# EAGLE design Automotive Car Cover with anti-theft alert system (EAGLE 7.6.0)
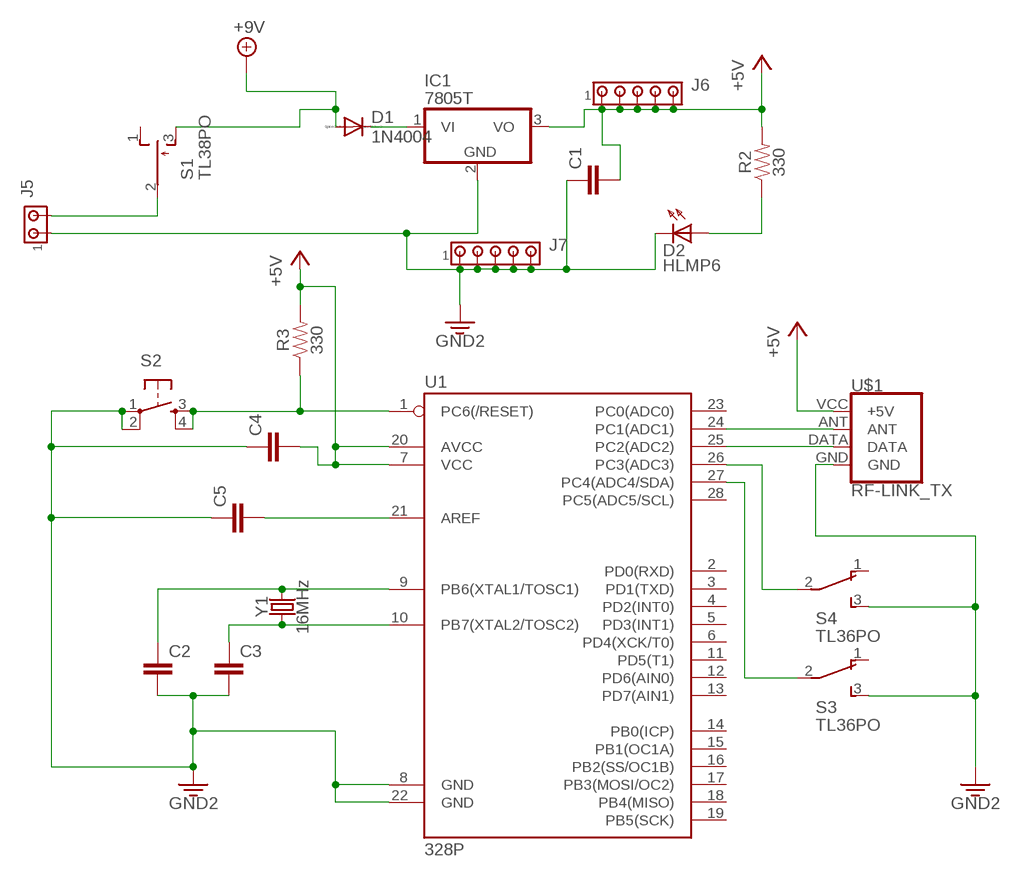
[diagram p0: schematic, sheet 1]

## Parts
C1  C5/2.5  [C5B2.5]
C2  C5/2.5  [C5B2.5]
C3  C5/2.5  [C5B2.5]
C4  C5/2.5  [C5B2.5]
C5  C5/2.5  [C5B2.5]
D1  1N4004  [DO41-10]
D2  HLMP6  [HLMP6]
IC1  7805T  [TO220H]
J5  MTA02-156  [1X2MTA]
J6  MTA05-100  [10X05MTA]
J7  MTA05-100  [10X05MTA]
R2  330  330OHM-HORIZ-1/10W-5%  [AXIAL-0.3]
R3  330  330OHM-HORIZ-1/10W-5%  [AXIAL-0.3]
S1  TL38PO  [TL3XPO]
S2  TAC_SWITCHPTH  [TACTILE-PTH]
S3  TL36PO  [TL3XPO]
S4  TL36PO  [TL3XPO]
U1  328P  ATMEGA328P_PDIP  [DIP28]
U$1  RF-LINK_TX  [RF-LINK_TX]
Y1  16MHz  CRYSTAL-16MHZPTH-HC49US  [HC49US]

## Nets
3.3V: C1.1 C2.2 C3.2 C4.1 C5.1 D2.K IC1.2(GND) J5.1 J7.1 J7.2 J7.3 J7.4 J7.5 S2.1 S2.2 S3.3(S) S4.3(S) U1.8(GND) U1.22(GND) U$1.GND ; supply symbol labelled GND2
+5V: C1.2 C4.2 IC1.3(VO) J6.1 J6.2 J6.3 J6.4 J6.5 R2.P$2 R3.P$2 U1.7(VCC) U1.20(AVCC) U$1.VCC(+5V)
+9V: D1.A S1.3(S)
N$1: R3.P$1 S2.3 S2.4 U1.1(PC6(/RESET))
N$3: U1.25(PC2(ADC2)) U$1.DATA
N$4: C5.2 U1.21(AREF)
N$5: C2.1 U1.9(PB6(XTAL1/TOSC1)) Y1.2
N$6: S4.2(P) U1.26(PC3(ADC3))
N$7: D2.A R2.P$1
N$8: C3.1 U1.10(PB7(XTAL2/TOSC2)) Y1.1
N$9: S3.2(P) U1.27(PC4(ADC4/SDA))
N$11: U1.24(PC1(ADC1)) U$1.ANT
N$14: J5.2 S1.2(P)
N$16: D1.C IC1.1(VI)
Unconnected: S1.1(O) S3.1(O) S4.1(O) U1.2(PD0(RXD)) U1.3(PD1(TXD)) U1.4(PD2(INT0)) U1.5(PD3(INT1)) U1.6(PD4(XCK/T0)) U1.11(PD5(T1)) U1.12(PD6(AIN0)) U1.13(PD7(AIN1)) U1.14(PB0(ICP)) U1.15(PB1(OC1A)) U1.16(PB2(SS/OC1B)) U1.17(PB3(MOSI/OC2)) U1.18(PB4(MISO)) U1.19(PB5(SCK)) U1.23(PC0(ADC0)) U1.28(PC5(ADC5/SCL))

## Library data of the parts
C1-C5 = capacitor-wima:C: CAPACITOR naming: grid - package width
D1 = diode:1N4004: DIODE general purpose rectifier, 1 A
D2 = display-hp:HLMP6: LED 2mm horizontal; MF: AGILENT TECHNOLOGIES; MPN: HLMP-6500; OC_FARNELL: 1652490; OC_NEWARK: 40K0088
IC1 = linear:78*: Positive VOLTAGE REGULATOR Source: http://cache.national.com/ds/LM/LM78L05.pdf http://www.fairchildsemi.com/ds/LM/LM7805.pdf
J5 = con-amp:MTA02-156: AMP connector
J6 J7 = con-amp:MTA05-100: AMP connector
R2 R3 = SparkFun-Resistors:330OHM: 330Ω resistor A resistor is a passive two-terminal electrical component that implements electrical resistance as a circuit element. Resistors act to reduce current flow, and, at the same time, act to lower voltage levels within circuits. - Wikipedia; PROD_ID: RES-8371
S1 = switch:TL38PO: TINY SWITCH ON OFF MOM Source: http://www2.produktinfo.conrad.com/datenblaetter/700000-724999/705152-da-01-de-Subminiaturschalter_TL_36YO.pdf
S2 = SparkFun-Retired:TAC_SWITCH: Momentary Switch Button commonly used for reset or general input. Spark Fun Electronics SKU : COM-00097 SMT- SWCH-08247
S3 S4 = switch:TL36PO: TINY SWITCH ON - ON Source: http://www2.produktinfo.conrad.com/datenblaetter/700000-724999/705152-da-01-de-Subminiaturschalter_TL_36YO.pdf
U1 = SparkFun-IC-Microcontroller:ATMEGA328P_PDIP: Atmel 328P Through hole ATMEGA328P uC used in the Arduino 32kb flash, 1k EEPROM, 2k SRAM Datasheet <http://www.sparkfun.com/datasheets/Components/SMD/ATMega328.pdf> SparkFun Products Storefront component: AVR 28 Pin 20MHz 32K 6A/D - ATMega328P <https://www.sparkfun.com/products/9061> (COM-09061) SparkFun Simon Says - Through-Hole Soldering Kit <https://www.sparkfun.com/products/10547> (KIT-10547) SparkFun Learn to Solder - Simon Says <https://www.sparkfun.com/products/13708> (KIT-13708) SparkFun BigTime Watch Kit <https://www.sparkfun.com/products/11734> (KIT-11734) SparkFun ClockIt <https://www.sparkfun.com/products/10930> (KIT-10930) SparkFun Serial Enabled LCD Kit <https://www.sparkfun.com/products/10097> (LCD-10097) SparkFun Simon Tilts - Through Hole Soldering Kit <https://www.sparkfun.com/products/12634> (KIT-12634) SparkFun Frequency Counter Kit <https://www.sparkfun.com/products/10140> (KIT-10140) FabFM Radio Kit <https://www.sparkfun.com/products/11043> (KIT-11043) SparkFun Binary Blaster Kit <https://www.sparkfun.com/products/12037> (KIT-12037) SparkFun Metro-Gnome <https://www.sparkfun.com/products/9236> (KIT-09236) ATmega328 with Arduino Optiboot (Uno) <https://www.sparkfun.com/products/10524> (DEV-10524); PROD_ID: IC-09136
U$1 = SparkFun-RF:RF-LINK_TX: RF Link Transmitter (434 MHz, 315 MHz) These wireless transmitters work with equivalent receivers. They can easily fit into a breadboard and work well with microcontrollers to create a very simple wireless data link. Since these are only transmitters, they will only work communicating data one-way, you would need two pairs (of different frequencies) to act as a transmitter/receiver pair. SparkFun Products RF Link Transmitter - 434MHz <https://www.sparkfun.com/products/10534> (WRL-10534); SF_ID: WRL-10534
Y1 = SparkFun-Clocks:CRYSTAL-16MHZ: 16MHz Crystal Digikey Example <http://www.digikey.com/product-search/en?keywords=535-9122-1-ND> Frequency: 16MHz Frequency Stability: ±50ppm Frequency Tolerance: ±20ppm Load Capacitance: 18pF SparkFun Products: Pro Micro -5V/16MHz <https://www.sparkfun.com/products/12640> SparkFun Serial Enabled LCD Kit <https://www.sparkfun.com/products/10097>; PROD_ID: XTAL-08181; SF_ID: COM-00536

## Board
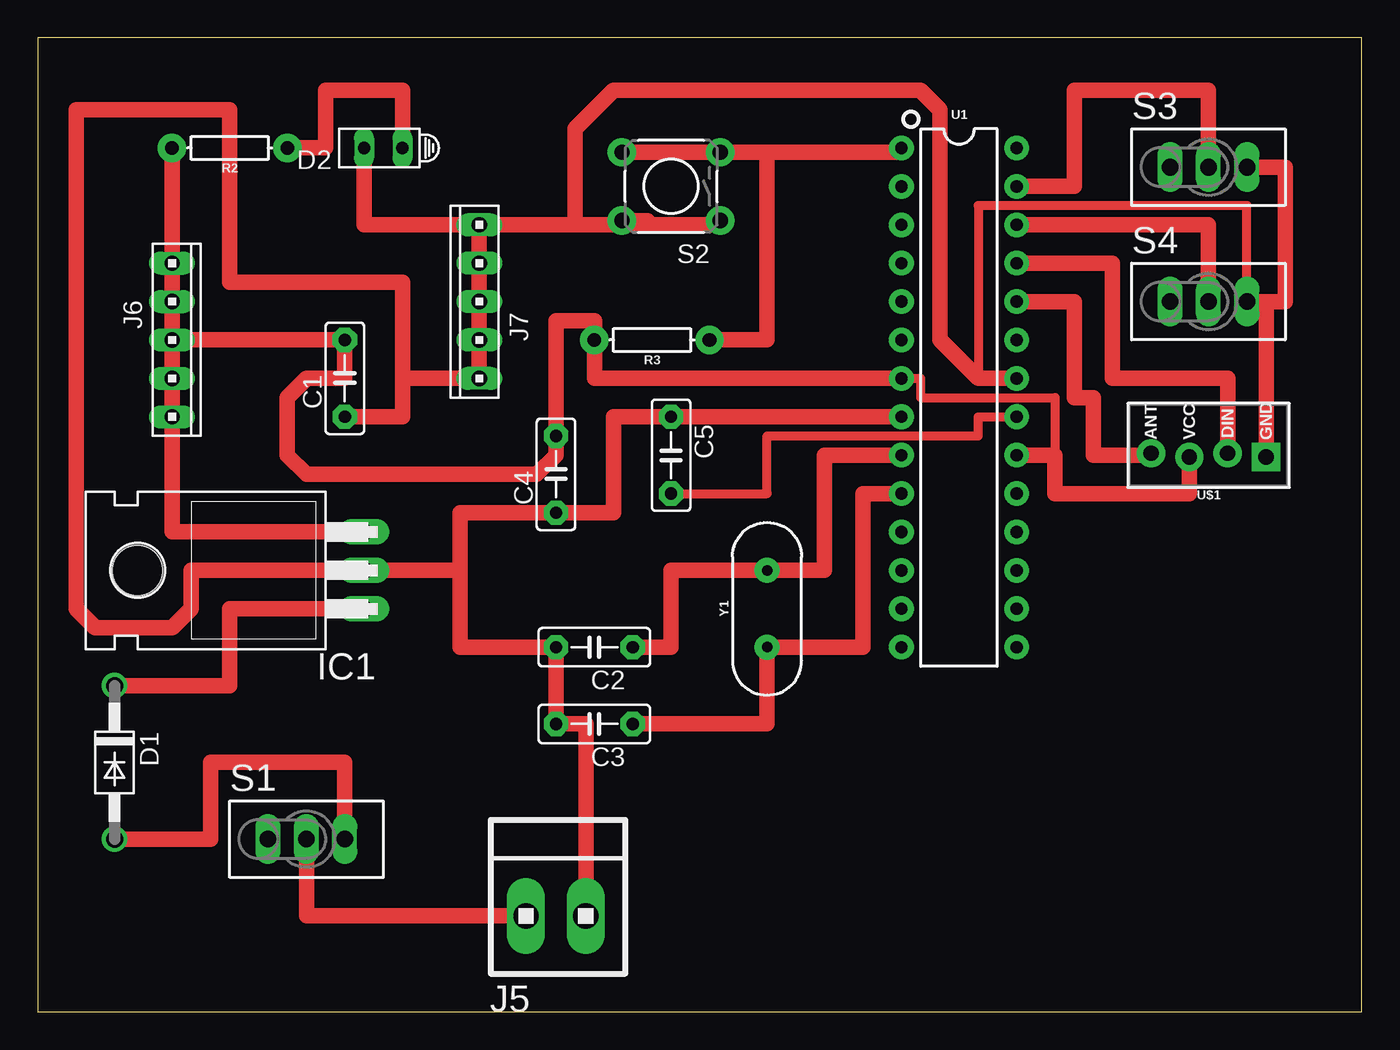
[diagram p1: board, top side]
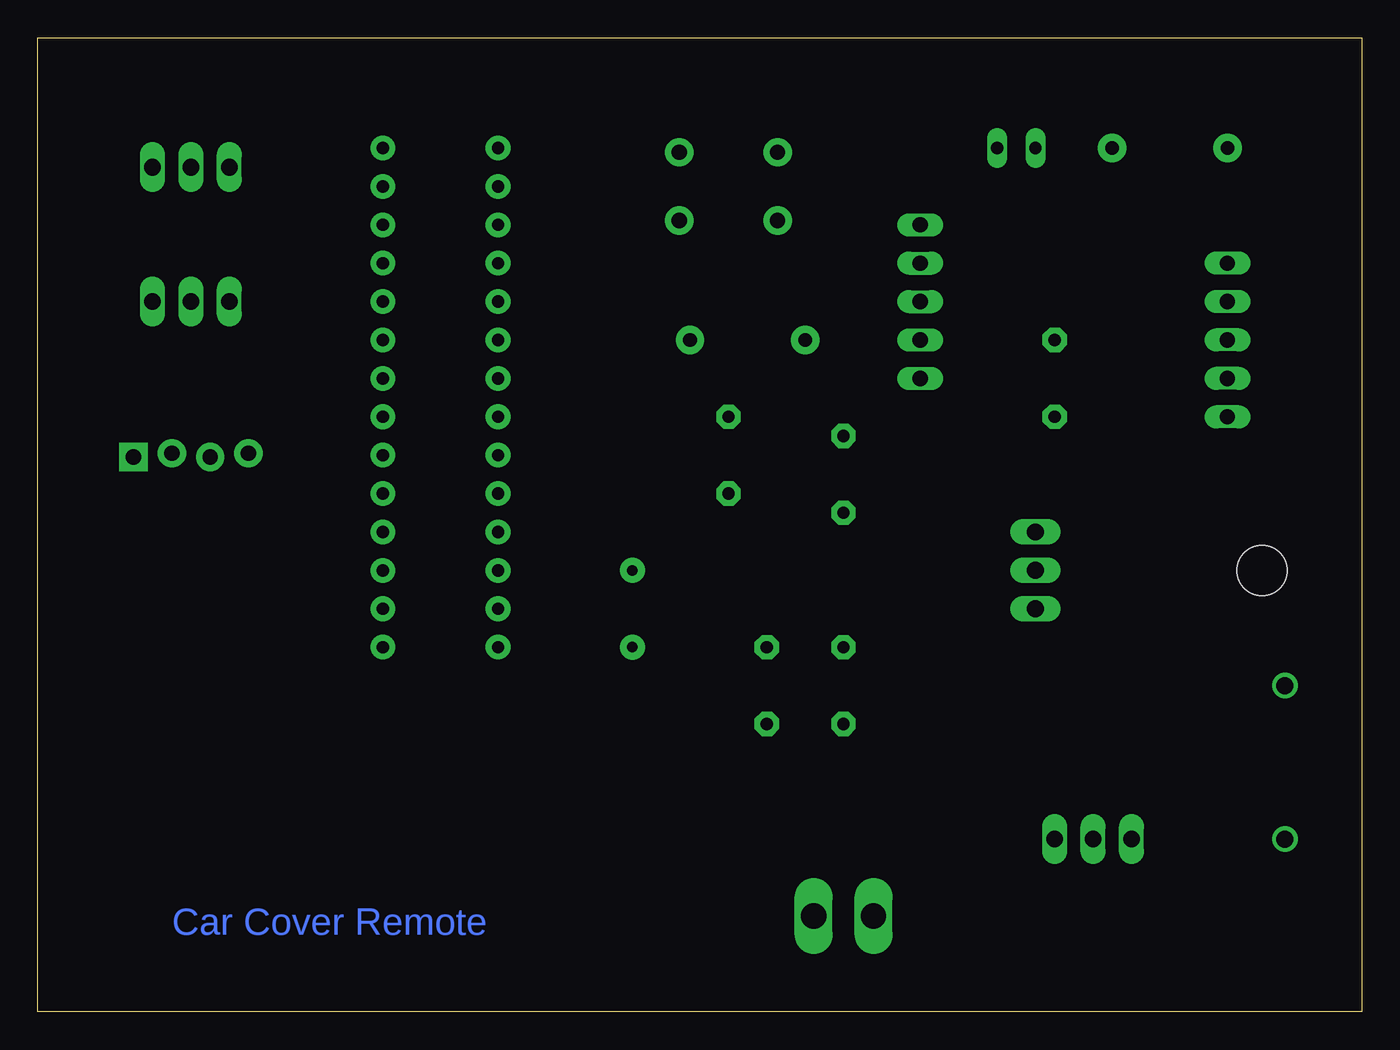
[diagram p2: board, bottom side, seen from below]

Size 87.61 x 64.44 mm. Coordinates in mm from the lower left corner, seen from the top.
Outline: 0,0 87.61,0 87.61,64.44 0,64.44 0,0
Copper layers (1*16): Top 0.035mm / dielectric 1.5mm / Bottom 0.035mm
Design rules "default": minimum track width 10mil, minimum drill 24mil, track to track 8mil, track to pad 8mil, pad to pad 8mil, via to via 8mil, smd to smd 8mil, copper to edge 40mil, drill to drill 8mil, minimum pad ring 10mil, minimum via ring 8mil, stop-mask expansion 4mil, vias tented up to drill 0mil, thermal gap 10mil

### Footprints (pad centres in the part's own frame; a part is rotated, then mirrored left to right if it is on the bottom)
C5B2.5 = drill 0.813 pad 1.6 octagon: 1 -2.54,0; 2 2.54,0
DO41-10 = drill 1.118: A 5.08,0; C -5.08,0
HLMP6 = drill 0.813 long: A -1.27,0; K 1.27,0
TO220H = drill 1.118 long: 1 -2.54,-10.16; 2 0,-10.16; 3 2.54,-10.16 | hole 3.302: 0,4.826
1X2MTA = drill 1.676 long: 1 1.981,0; 2 -1.981,0
10X05MTA = drill 1.016 long: 1 5.08,0; 2 2.54,0; 3 0,0; 4 -2.54,0; 5 -5.08,0
AXIAL-0.3 = drill 0.9 pad 1.88: P$1 -3.81,0; P$2 3.81,0
TL3XPO = drill 1.1 pad 1.422 long: 1 -2.54,0; 2 0,0; 3 2.54,0
TACTILE-PTH = drill 1.016 pad 1.88: 1 -3.251,2.261; 2 3.251,2.261; 3 -3.251,-2.261; 4 3.251,-2.261
DIP28 = drill 0.813 pad 1.626: 1 -16.51,-3.81; 2 -13.97,-3.81; 3 -11.43,-3.81; 4 -8.89,-3.81; 5 -6.35,-3.81; 6 -3.81,-3.81; 7 -1.27,-3.81; 8 1.27,-3.81; 9 3.81,-3.81; 10 6.35,-3.81; 11 8.89,-3.81; 12 11.43,-3.81; 13 13.97,-3.81; 14 16.51,-3.81; 15 16.51,3.81; 16 13.97,3.81; 17 11.43,3.81; 18 8.89,3.81; 19 6.35,3.81; 20 3.81,3.81; 21 1.27,3.81; 22 -1.27,3.81; 23 -3.81,3.81; 24 -6.35,3.81; 25 -8.89,3.81; 26 -11.43,3.81; 27 -13.97,3.81; 28 -16.51,3.81
RF-LINK_TX = drill 1.016 pad 1.88: ANT 3.81,-0.127; DATA -1.27,-0.127; VCC 1.27,0.127 | drill 1.016 pad 1.88 square: GND -3.81,0.127
HC49US = drill 0.7 pad 1.651: 1 -2.54,0; 2 2.54,0

### Placement (x,y rotation side)
C1  20.32,41.91 90 top
C2  36.83,24.13 180 top
C3  36.83,19.05 180 top
C4  34.29,35.56 90 top
C5  41.91,36.83 270 top
D1  5.08,16.51 270 top
D2  22.86,57.15 180 top
IC1  11.43,29.21 90 top
J5  34.29,6.35 0 top
J6  8.89,44.45 270 top
J7  29.21,46.99 90 top
R2  12.7,57.15 180 top
R3  40.64,44.45 180 top
S1  17.78,11.43 0 top
S2  41.91,54.61 180 top
S3  77.47,55.88 0 top
S4  77.47,46.99 0 top
U1  60.96,40.64 270 top
U$1  77.47,36.83 180 top
Y1  48.26,26.67 90 top

### Tracks (layer width: path | path; a pad name or v marks a point on that pad's centre or on a via)
3.3V
  Top 0.61: S4.3 80.01,53.34 62.23,53.34 62.23,41.91
  Top 1.016: J7.1 21.59,52.07 D2.K | J7.1 J7.2 J7.3 J7.4 J7.5 24.13,41.91 | C1.1 24.13,39.37 24.13,41.91 | 24.13,41.91 24.13,48.26 12.7,48.26 12.7,59.69 2.54,59.69 2.54,26.67 3.81,25.4 8.89,25.4 10.16,26.67 10.16,29.21 IC1.2 27.94,29.21 | J5.1 36.27,19.05 C3.2 C2.2 27.94,24.13 27.94,29.21 | 27.94,29.21 27.94,33.02 C4.1 38.1,33.02 38.1,39.37 C5.1 U1.8 | S3.3 82.55,55.88 82.55,46.99 S4.3 81.28,46.99 U$1.GND | J7.1 35.56,52.07 | 35.56,52.07 40.64,52.07 | 40.64,52.07 40.36,52.35 S2.2 | S2.1 44.88,52.07 40.64,52.07 | 35.56,52.07 35.56,58.42 38.1,60.96 58.42,60.96 59.69,59.69 59.69,44.45 62.23,41.91 U1.22
+5V
  Top 0.61: U1.7 58.42,41.91 58.42,40.64 67.31,40.64 67.31,36.83
  Top 1.016: IC1.3 8.89,31.75 J6.1 J6.2 J6.3 | J6.3 J6.4 J6.5 R2.P$2 | J6.3 C1.2 20.32,41.91 17.78,41.91 16.51,40.64 16.51,36.83 17.78,35.56 33.02,35.56 34.29,36.83 C4.2 34.29,45.72 36.83,45.72 R3.P$2 36.83,41.91 U1.7 | U1.20 67.31,36.83 67.31,34.29 76.2,34.29 U$1.VCC
+9V
  Top 1.016: D1.A 11.43,11.43 11.43,16.51 20.32,16.51 S1.3
N$1
  Top 1.016: S2.4 S2.3 48.26,56.87 | 48.26,56.87 57.15,56.87 U1.1 | R3.P$1 48.26,44.45 48.26,56.87
N$3
  Top 1.016: U1.25 71.12,49.53 71.12,41.91 78.74,41.91 U$1.DATA
N$4
  Top 0.61: C5.2 48.26,34.29 48.26,38.1 62.23,38.1 62.23,39.37 U1.21
N$5
  Top 1.016: C2.1 41.91,24.13 41.91,29.21 Y1.2 52.07,29.21 52.07,36.83 U1.9
N$6
  Top 1.016: U1.26 77.47,52.07 S4.2
N$7
  Top 1.016: R2.P$1 19.05,57.15 19.05,60.96 24.13,60.96 D2.A
N$8
  Top 1.016: C3.1 48.26,19.05 Y1.1 54.61,24.13 54.61,34.29 U1.10
N$9
  Top 1.016: U1.27 68.58,54.61 68.58,60.96 77.47,60.96 S3.2
N$11
  Top 1.016: U1.24 68.58,46.99 68.58,40.64 69.85,40.64 69.85,36.83 73.66,36.83 U$1.ANT
N$14
  Top 1.016: S1.2 17.78,6.35 J5.2
N$16
  Top 1.016: D1.C 12.7,21.59 12.7,26.67 IC1.1

### Text on the board
Bottom: Car Cover Remote